# EAGLE design 12-pin SOIC+TSSOP (EAGLE 6.2)
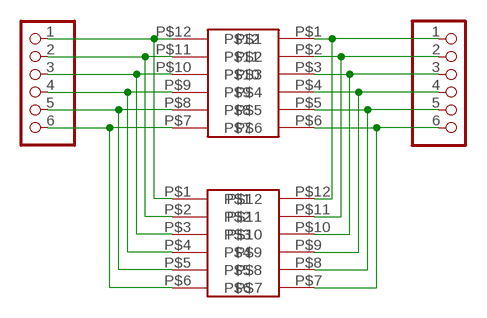
[diagram p0: schematic, sheet 1]

## Parts
JP1  PADS-6  [PADS-6]
JP2  PADS-6  [PADS-6]
U$1  12-PINTSSOP-NW  [TSSOP12-NW]
U$2  12-PINSOIC-NW  [SO12-NW]

## Nets
N$2: JP2.2 U$1.P$11 U$2.P$2
N$3: JP2.3 U$1.P$10 U$2.P$3
N$4: JP2.4 U$1.P$9 U$2.P$4
N$5: JP2.5 U$1.P$8 U$2.P$5
N$6: JP2.6 U$1.P$7 U$2.P$6
N$7: JP1.1 U$1.P$1 U$2.P$12
N$8: JP1.2 U$1.P$2 U$2.P$11
N$9: JP1.3 U$1.P$3 U$2.P$10
N$10: JP1.4 U$1.P$4 U$2.P$9
N$11: JP1.5 U$1.P$5 U$2.P$8
N$12: JP1.6 U$1.P$6 U$2.P$7
N$13: JP2.1 U$1.P$12 U$2.P$1

## Library data of the parts
JP1 JP2 = breakouts:PADS-6: PIN HEADER
U$1 U$2 = breakouts:12-PIN

## Board
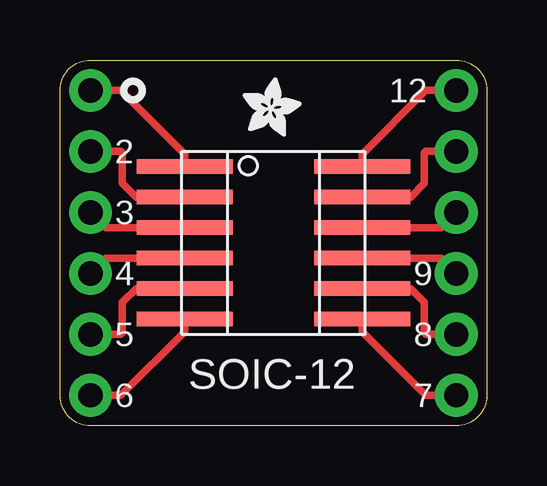
[diagram p1: board, top side]
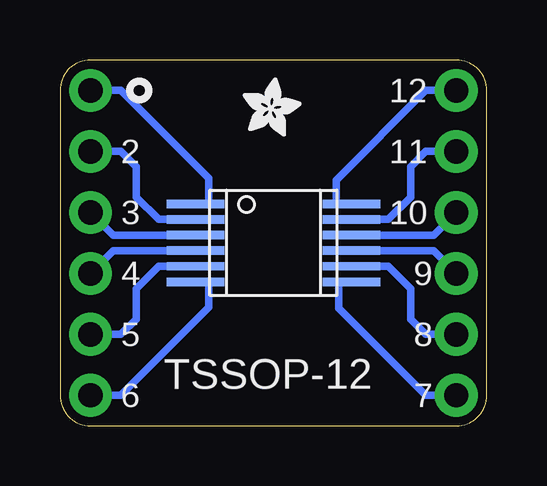
[diagram p2: board, bottom side, seen from below]

Size 17.78 x 15.24 mm. Coordinates in mm from the lower left corner, seen from the top.
Outline: 0,1.27 0,13.97 arc-90 1.27,15.24 16.51,15.24 arc-90 17.78,13.97 17.78,1.27 arc-90 16.51,0 1.27,0 arc-90 0,1.27
Copper layers (1*16): Top 0.035mm / dielectric 1.5mm / Bottom 0.035mm
Design rules: minimum track width 10mil, minimum drill 16mil, track to track 8mil, track to pad 8mil, pad to pad 8mil, via to via 8mil, smd to smd 8mil, copper to edge 10mil, drill to drill 8mil, minimum pad ring 10mil, minimum via ring 8mil, stop-mask expansion 4mil, vias tented up to drill 20mil, thermal gap 10mil

### Footprints (pad centres in the part's own frame; a part is rotated, then mirrored left to right if it is on the bottom)
PADS-6 = drill 1.016 pad 1.778: 1 -6.35,0; 2 -3.81,0; 3 -1.27,0; 4 1.27,0; 5 3.81,0; 6 6.35,0
TSSOP12-NW = smd 2.4 x 0.35: P$1 -3.25,1.625; P$2 -3.25,0.975; P$3 -3.25,0.325; P$4 -3.25,-0.325; P$5 -3.25,-0.975; P$6 -3.25,-1.625; P$7 3.25,-1.625; P$8 3.25,-0.975; P$9 3.25,-0.325; P$10 3.25,0.325; P$11 3.25,0.975; P$12 3.25,1.625
SO12-NW = smd 4 x 0.6: P$1 -3.7,3.175; P$2 -3.7,1.905; P$3 -3.7,0.635; P$4 -3.7,-0.635; P$5 -3.7,-1.905; P$6 -3.7,-3.175; P$7 3.7,-3.175; P$8 3.7,-1.905; P$9 3.7,-0.635; P$10 3.7,0.635; P$11 3.7,1.905; P$12 3.7,3.175

### Placement (x,y rotation side)
JP1  16.51,7.62 270 top
JP2  1.27,7.62 270 top
U$1  8.89,7.62 0 bottom
U$2  8.89,7.62 0 top
U$3  [ADAFRUIT_2.5MM]  7.62,12.07 0 top
U$4  [ADAFRUIT_2.5MM]  10.16,12.07 0 bottom

### Tracks (layer width: path | path; a pad name or v marks a point on that pad's centre or on a via)
N$2
  Top 0.305: U$2.P$2 3.18,9.53 2.6,10.1 2.6,11.37 2.54,11.43 JP2.2
  Bottom 0.305: U$1.P$11 4.11,8.6 3.18,9.53 3.18,10.79 2.54,11.43 JP2.2
N$3
  Top 0.305: U$2.P$3 1.91,8.26 JP2.3
  Bottom 0.305: U$1.P$10 2.22,7.95 JP2.3
N$4
  Top 0.305: U$2.P$4 1.91,6.99 JP2.4
  Bottom 0.305: U$1.P$9 2.22,7.29 JP2.4
N$5
  Top 0.305: U$2.P$5 3.18,5.71 2.6,5.14 2.6,3.87 2.54,3.81 JP2.5
  Bottom 0.305: U$1.P$8 4.11,6.65 3.18,5.71 3.18,4.45 2.54,3.81 JP2.5
N$6
  Top 0.305: U$2.P$6 5.19,3.92 2.54,1.27 JP2.6
  Bottom 0.305: JP2.6 2.54,1.27 6.17,4.9 6.17,5.94 6.12,6 U$1.P$7
N$7
  Top 0.305: U$2.P$12 12.59,11.32 15.24,13.97 JP1.1
  Bottom 0.305: JP1.1 15.24,13.97 11.58,10.31 11.58,9.22 11.61,9.25 U$1.P$1
N$8
  Top 0.305: U$2.P$11 14.61,9.53 15.18,10.1 15.18,11.37 15.24,11.43 JP1.2
  Bottom 0.305: U$1.P$2 13.68,8.6 14.61,9.53 14.61,10.79 15.24,11.43 JP1.2
N$9
  Top 0.305: U$2.P$10 15.88,8.26 JP1.3
  Bottom 0.305: U$1.P$3 15.57,7.95 JP1.3
N$10
  Top 0.305: U$2.P$9 15.88,6.99 JP1.4
  Bottom 0.305: U$1.P$4 15.57,7.29 JP1.4
N$11
  Top 0.305: U$2.P$8 14.61,5.71 15.18,5.14 15.18,3.87 15.24,3.81 JP1.5
  Bottom 0.305: U$1.P$5 13.68,6.65 14.61,5.71 14.61,4.45 15.24,3.81 JP1.5
N$12
  Top 0.305: U$2.P$7 12.59,3.92 15.24,1.27 JP1.6
  Bottom 0.305: JP1.6 15.24,1.27 11.58,4.93 11.58,5.97 11.61,6 U$1.P$6
N$13
  Top 0.305: U$2.P$1 5.19,11.32 2.54,13.97 JP2.1
  Bottom 0.305: JP2.1 2.54,13.97 6.27,10.24 6.27,9.25 U$1.P$12

### Text on the board
tPlace: 12 | 2 | 3 | 4 | 9 | 5 | 8 | SOIC-12 | 6 | 7
bPlace: 12 | 11 | 2 | 10 | 3 | 9 | 4 | 8 | 5 | TSSOP-12 | 7 | 6